# EAGLE design schematic (EAGLE 7.5.0)
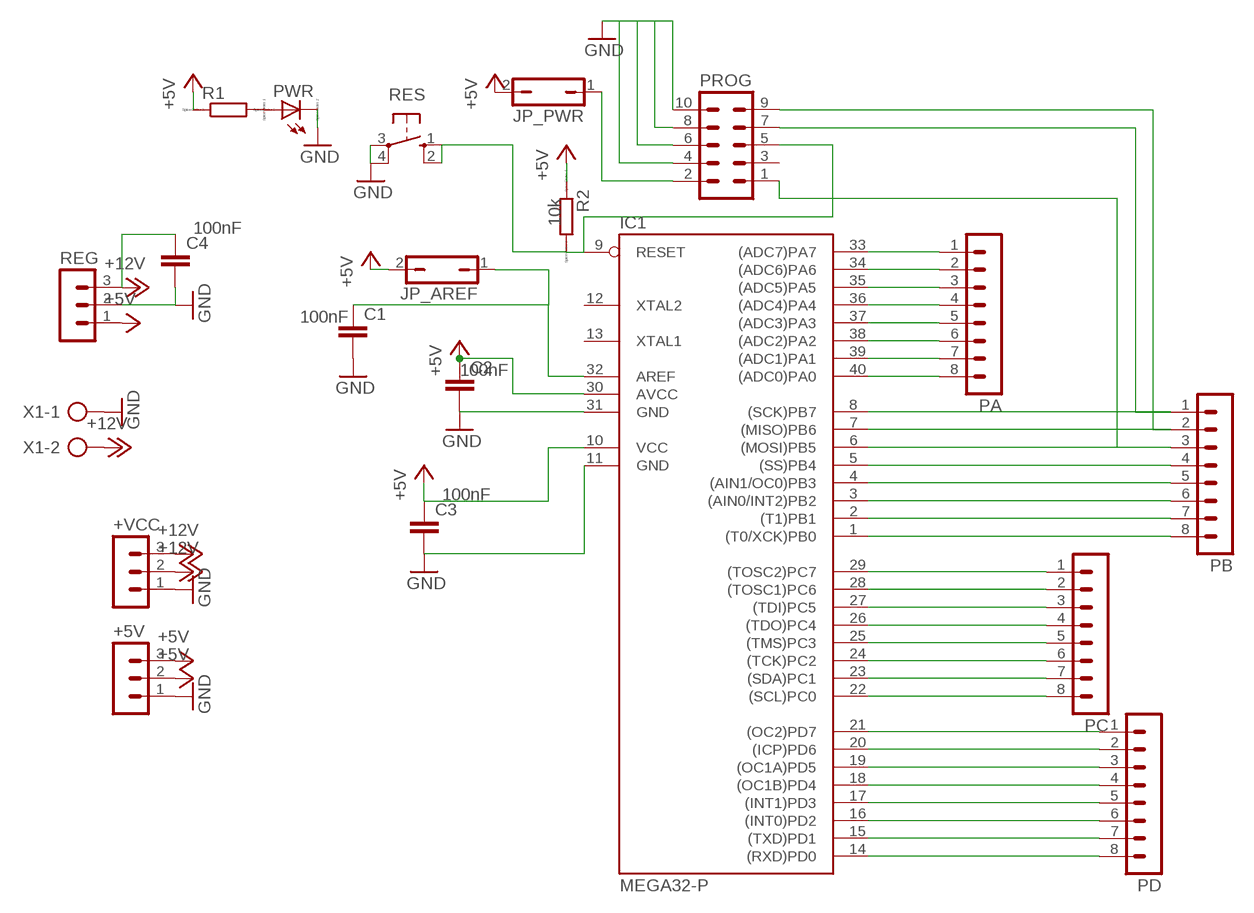
[diagram p0: schematic, sheet 1]

## Parts
+5V  MA03-1  [MA03-1]
+VCC  MA03-1  [MA03-1]
C1  C2,5-3  [C2.5-3]
C2  C2,5-3  [C2.5-3]
C3  C2,5-3  [C2.5-3]
C4  C2,5-3  [C2.5-3]
IC1  MEGA32-P  [DIL40]
JP_AREF  JP1Q  [JP1]
JP_PWR  JP1Q  [JP1]
PA  MA08-1  [MA08-1]
PB  MA08-1  [MA08-1]
PC  MA08-1  [MA08-1]
PD  MA08-1  [MA08-1]
PROG  MA05-2  [MA05-2]
PWR  LED_E  [LED_1206]
R1  RR1206  [R1206]
R2  RR1206  [R1206]
REG  MA03-1  [MA03-1]
RES  10-XX  [B3F-10XX]
X1  AK300/2  [AK300/2]

## Nets
+5V: +5V.2 +5V.3 C2.1 C3.1 IC1.10(VCC) IC1.30(AVCC) JP_AREF.2 JP_PWR.2 R1.1 R2.1 REG.1
+12V: +VCC.2 +VCC.3 C4.1 REG.3 X1.2
GND: +5V.1 +VCC.1 C1.2 C2.2 C3.2 C4.2 IC1.11(GND) IC1.31(GND) PROG.4 PROG.6 PROG.8 PROG.10 PWR.C REG.2 RES.3(P) RES.4(P1) X1.1
N$1: IC1.21((OC2)PD7) PD.1
N$2: IC1.20((ICP)PD6) PD.2
N$3: IC1.19((OC1A)PD5) PD.3
N$4: IC1.18((OC1B)PD4) PD.4
N$5: IC1.17((INT1)PD3) PD.5
N$6: IC1.16((INT0)PD2) PD.6
N$7: IC1.15((TXD)PD1) PD.7
N$8: IC1.14((RXD)PD0) PD.8
N$9: IC1.29((TOSC2)PC7) PC.1
N$10: IC1.28((TOSC1)PC6) PC.2
N$11: IC1.27((TDI)PC5) PC.3
N$12: IC1.26((TDO)PC4) PC.4
N$13: IC1.25((TMS)PC3) PC.5
N$14: IC1.24((TCK)PC2) PC.6
N$15: IC1.23((SDA)PC1) PC.7
N$16: IC1.22((SCL)PC0) PC.8
N$17: IC1.8((SCK)PB7) PB.1 PROG.7
N$18: IC1.7((MISO)PB6) PB.2 PROG.9
N$19: IC1.6((MOSI)PB5) PB.3 PROG.1
N$20: IC1.5((SS)PB4) PB.4
N$21: IC1.4((AIN1/OC0)PB3) PB.5
N$22: IC1.3((AIN0/INT2)PB2) PB.6
N$23: IC1.2((T1)PB1) PB.7
N$24: IC1.1((T0/XCK)PB0) PB.8
N$25: IC1.33((ADC7)PA7) PA.1
N$26: IC1.34((ADC6)PA6) PA.2
N$27: IC1.35((ADC5)PA5) PA.3
N$28: IC1.36((ADC4)PA4) PA.4
N$29: IC1.37((ADC3)PA3) PA.5
N$30: IC1.38((ADC2)PA2) PA.6
N$31: IC1.39((ADC1)PA1) PA.7
N$32: IC1.40((ADC0)PA0) PA.8
N$33: IC1.9(RESET) PROG.5 R2.2 RES.1(S) RES.2(S1)
N$35: C1.1 IC1.32(AREF) JP_AREF.1
N$37: JP_PWR.1 PROG.2
N$42: PWR.A R1.2
Unconnected: IC1.12(XTAL2) IC1.13(XTAL1) PROG.3

## Library data of the parts
+5V +VCC REG = con-lstb:MA03-1: PIN HEADER; OC_FARNELL: unknown; OC_NEWARK: unknown
C1-C4 = capacitor-wima:C: CAPACITOR naming: grid - package width; CAPACITY: 100nF
IC1 = atmel:MEGA32-P: MICROCONTROLLER 32 Kbytes FLASH 2 Kbytes SRAM 1 Kbytes EEPROM USART 8-channel 10 bit ADC Source: www.atmel.com .. doc2503.pdf; MPN: ATMEGA32-16PU; OC_FARNELL: 1661729; OC_NEWARK: 51P1794
JP_AREF JP_PWR = jumper:JP1Q: JUMPER
PA PB PC PD = con-lstb:MA08-1: PIN HEADER; OC_FARNELL: unknown; OC_NEWARK: unknown
PROG = con-lstb:MA05-2: PIN HEADER; OC_FARNELL: unknown; OC_NEWARK: unknown
PWR = eagle-ltspice:LED_E: LED Source: http://www.osram.convergy.de Source: www.luxeon.com Source: www.kingbright.com; SPICEMODEL: NONE; SPICEPREFIX: D; SPICETYPE: diode
R1 = eagle-ltspice:R: RESISTOR, European symbol; SPICEMODEL: NONE; SPICEPREFIX: R
R2 = eagle-ltspice:R: RESISTOR, European symbol; SPICEMODEL: 10k; SPICEPREFIX: R
RES = switch-omron:10-XX: OMRON SWITCH; MPN: B3F-1000; OC_FARNELL: 176432; OC_NEWARK: 36M3542
X1 = con-ptr500:AK300/2: CONNECTOR; OC_FARNELL: unknown; OC_NEWARK: unknown

## Board
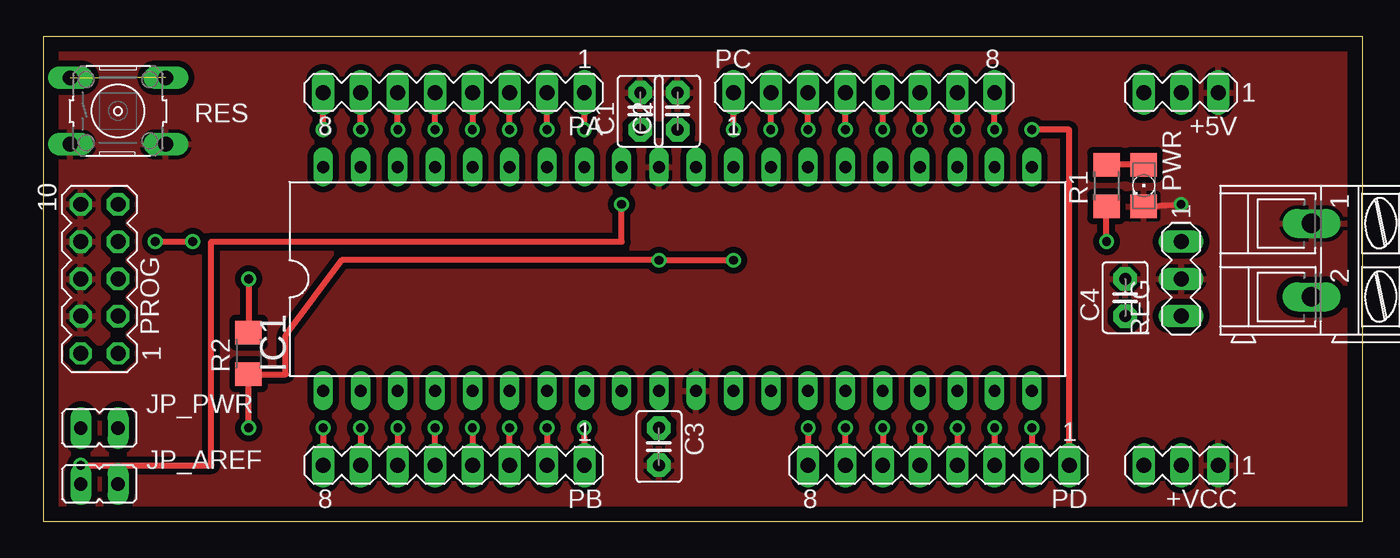
[diagram p1: board, top side]
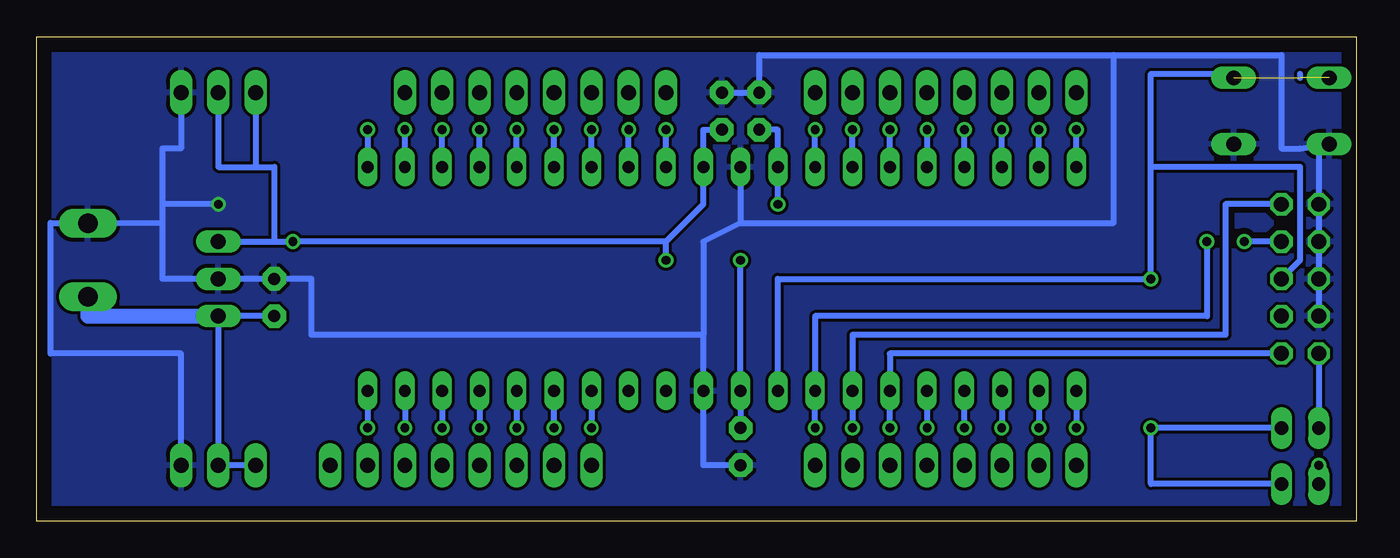
[diagram p2: board, bottom side, seen from below]

Size 89.84 x 33.01 mm. Coordinates in mm from the lower left corner, seen from the top.
Outline: 0,0 89.84,0 89.84,33.01 0,33.01 0,0
Copper layers (1*16): Top 0.035mm / dielectric 1.5mm / Bottom 0.035mm
Design rules "default": minimum track width 10mil, minimum drill 24mil, track to track 8mil, track to pad 8mil, pad to pad 8mil, via to via 8mil, smd to smd 8mil, copper to edge 40mil, drill to drill 8mil, minimum pad ring 10mil, minimum via ring 8mil, stop-mask expansion 4mil, vias tented up to drill 0mil, thermal gap 10mil

### Footprints (pad centres in the part's own frame; a part is rotated, then mirrored left to right if it is on the bottom)
MA03-1 = drill 1.016 long: 1 -2.54,0; 2 0,0; 3 2.54,0
C2.5-3 = drill 0.813 pad 1.6 octagon: 1 -1.27,0; 2 1.27,0
DIL40 = drill 0.813 long: 1 -24.13,-7.62; 2 -21.59,-7.62; 3 -19.05,-7.62; 4 -16.51,-7.62; 5 -13.97,-7.62; 6 -11.43,-7.62; 7 -8.89,-7.62; 8 -6.35,-7.62; 9 -3.81,-7.62; 10 -1.27,-7.62; 11 1.27,-7.62; 12 3.81,-7.62; 13 6.35,-7.62; 14 8.89,-7.62; 15 11.43,-7.62; 16 13.97,-7.62; 17 16.51,-7.62; 18 19.05,-7.62; 19 21.59,-7.62; 20 24.13,-7.62; 21 24.13,7.62; 22 21.59,7.62; 23 19.05,7.62; 24 16.51,7.62; 25 13.97,7.62; 26 11.43,7.62; 27 8.89,7.62; 28 6.35,7.62; 29 3.81,7.62; 30 1.27,7.62; 31 -1.27,7.62; 32 -3.81,7.62; 33 -6.35,7.62; 34 -8.89,7.62; 35 -11.43,7.62; 36 -13.97,7.62; 37 -16.51,7.62; 38 -19.05,7.62; 39 -21.59,7.62; 40 -24.13,7.62
JP1 = drill 0.914 long: 1 0,-1.27; 2 0,1.27
MA08-1 = drill 1.016 long: 1 -8.89,0; 2 -6.35,0; 3 -3.81,0; 4 -1.27,0; 5 1.27,0; 6 3.81,0; 7 6.35,0; 8 8.89,0
MA05-2 = drill 1.016 octagon: 1 -5.08,-1.27; 2 -5.08,1.27; 3 -2.54,-1.27; 4 -2.54,1.27; 5 0,-1.27; 6 0,1.27; 7 2.54,-1.27; 8 2.54,1.27; 9 5.08,-1.27; 10 5.08,1.27
LED_1206 = smd 1.6 x 1.803: A -1.422,0; C 1.422,0
R1206 = smd 1.6 x 1.803: 1 -1.422,0; 2 1.422,0
B3F-10XX = drill 1.016 long: 1 -3.251,2.261; 2 3.251,2.261; 3 -3.251,-2.261; 4 3.251,-2.261
AK300/2 = drill 1.321 long: 1 -2.515,0; 2 2.489,0

### Placement (x,y rotation side)
+5V  77.47,29.21 180 top
+VCC  77.47,3.81 180 top
C1  40.64,27.94 90 top
C2  43.18,27.94 90 top
C3  41.91,5.08 270 top
C4  73.66,15.24 90 top
IC1  43.18,16.51 0 top
JP_AREF  3.81,2.54 270 top
JP_PWR  3.81,6.35 270 top
PA  27.94,29.21 180 top
PB  27.94,3.81 180 top
PC  55.88,29.21 0 top
PD  60.96,3.81 180 top
PROG  3.81,16.51 90 top
PWR  74.93,22.86 270 top
R1  72.39,22.86 90 top
R2  13.97,11.43 90 top
REG  77.47,16.51 270 top
RES  5.08,27.94 0 top
X1  86.36,17.78 270 top

### Tracks (layer width: path | path; a pad name or v marks a point on that pad's centre or on a via)
+5V  (via drill 0.6)
  Top 0.406: v72.39,19.05 R1.1 | v46.99,17.78 v41.91,17.78 20.32,17.78 16.51,12.7 16.51,10.01 R2.1 v13.97,6.35
  Bottom 0.406: REG.1 73.66,19.05 | 73.66,19.05 v72.39,19.05 46.99,19.05 | C2.1 44.45,26.67 IC1.30 44.45,21.59 46.99,19.05 | C3.1 IC1.10 v41.91,17.78 | v46.99,17.78 46.99,19.05 | JP_PWR.2 v13.97,6.35 13.97,2.54 JP_AREF.2 | +5V.2 77.47,24.13 74.93,24.13 | 74.93,24.13 73.66,24.13 73.66,19.05 | +5V.3 74.93,24.13
+12V
  Bottom 0.406: C4.1 REG.3 +VCC.2 +VCC.3
  Bottom 1.016: X1.2 86.36,13.97 REG.3
GND  (via drill 0.6)
  Top 0.406: PWR.C v77.47,21.59
  Bottom 0.406: 44.45,12.7 44.45,19.05 41.91,20.32 | IC1.31 41.91,20.32 | 41.91,20.32 16.51,20.32 16.51,31.75 | 16.51,31.75 5.08,31.75 5.08,25.4 3.81,25.4 RES.3 2.54,25.4 PROG.10 PROG.8 PROG.6 PROG.4 | 44.45,12.7 71.12,12.7 71.12,16.51 C4.2 REG.2 81.28,16.51 81.28,20.32 | 44.45,12.7 IC1.11 44.45,3.81 C3.2 | C2.2 C1.2 40.64,31.75 16.51,31.75 | v77.47,21.59 81.28,21.59 | 81.28,21.59 81.28,20.32 | 81.28,20.32 X1.1 86.36,20.32 88.9,20.32 88.9,11.43 80.01,11.43 +VCC.1 | +5V.1 80.01,25.4 81.28,25.4 81.28,21.59
  pour Bottom (isolate 0.406): 0,33.02 90.17,33.02 90.17,0 0,0
  pour Top (isolate 0.406): 0,33.02 0,0 90.17,0 90.17,33.02
  pour Bottom: 0,33.02 90.17,33.02 90.17,0 0,0
N$1  (via drill 0.6)
  Top 0.406: PD.1 69.85,26.67 v67.31,26.67
  Bottom 0.406: v67.31,26.67 IC1.21
N$2  (via drill 0.6)
  Top 0.406: v67.31,6.35 PD.2
  Bottom 0.406: IC1.20 v67.31,6.35
N$3  (via drill 0.6)
  Top 0.406: v64.77,6.35 PD.3
  Bottom 0.406: IC1.19 v64.77,6.35
N$4  (via drill 0.6)
  Top 0.406: v62.23,6.35 PD.4
  Bottom 0.406: IC1.18 v62.23,6.35
N$5  (via drill 0.6)
  Top 0.406: v59.69,6.35 PD.5
  Bottom 0.406: IC1.17 v59.69,6.35
N$6  (via drill 0.6)
  Top 0.406: v57.15,6.35 PD.6
  Bottom 0.406: IC1.16 v57.15,6.35
N$7  (via drill 0.6)
  Top 0.406: PD.7 v54.61,6.35
  Bottom 0.406: v54.61,6.35 IC1.15
N$8  (via drill 0.6)
  Top 0.406: v52.07,6.35 PD.8
  Bottom 0.406: IC1.14 v52.07,6.35
N$9  (via drill 0.6)
  Top 0.406: v46.99,26.67 PC.1
  Bottom 0.406: IC1.29 v46.99,26.67
N$10  (via drill 0.6)
  Top 0.406: v49.53,26.67 PC.2
  Bottom 0.406: IC1.28 v49.53,26.67
N$11  (via drill 0.6)
  Top 0.406: v52.07,26.67 PC.3
  Bottom 0.406: IC1.27 v52.07,26.67
N$12  (via drill 0.6)
  Top 0.406: v54.61,26.67 PC.4
  Bottom 0.406: IC1.26 v54.61,26.67
N$13  (via drill 0.6)
  Top 0.406: v57.15,26.67 PC.5
  Bottom 0.406: IC1.25 v57.15,26.67
N$14  (via drill 0.6)
  Top 0.406: v59.69,26.67 PC.6
  Bottom 0.406: IC1.24 v59.69,26.67
N$15  (via drill 0.6)
  Top 0.406: v62.23,26.67 PC.7
  Bottom 0.406: IC1.23 v62.23,26.67
N$16  (via drill 0.6)
  Top 0.406: v64.77,26.67 PC.8
  Bottom 0.406: IC1.22 v64.77,26.67
N$17  (via drill 0.6)
  Top 0.406: PB.1 v36.83,6.35 | v7.62,19.05 v10.16,19.05
  Bottom 0.406: v36.83,6.35 IC1.8 36.83,13.97 10.16,13.97 v10.16,19.05 | PROG.7 v7.62,19.05
N$18  (via drill 0.6)
  Top 0.406: v34.29,6.35 PB.2
  Bottom 0.406: v34.29,6.35 IC1.7 34.29,12.7 8.89,12.7 8.89,21.59 PROG.9
N$19  (via drill 0.6)
  Top 0.406: PB.3 v31.75,6.35
  Bottom 0.406: v31.75,6.35 IC1.6 31.75,11.43 PROG.1
N$20  (via drill 0.6)
  Top 0.406: v29.21,6.35 PB.4
  Bottom 0.406: IC1.5 v29.21,6.35
N$21  (via drill 0.6)
  Top 0.406: PB.5 v26.67,6.35
  Bottom 0.406: v26.67,6.35 IC1.4
N$22  (via drill 0.6)
  Top 0.406: v24.13,6.35 PB.6
  Bottom 0.406: IC1.3 v24.13,6.35
N$23  (via drill 0.6)
  Top 0.406: v21.59,6.35 PB.7
  Bottom 0.406: IC1.2 v21.59,6.35
N$24  (via drill 0.6)
  Top 0.406: v19.05,6.35 PB.8
  Bottom 0.406: IC1.1 v19.05,6.35
N$25  (via drill 0.6)
  Top 0.406: v36.83,26.67 PA.1
  Bottom 0.406: IC1.33 v36.83,26.67
N$26  (via drill 0.6)
  Top 0.406: v34.29,26.67 PA.2
  Bottom 0.406: IC1.34 v34.29,26.67
N$27  (via drill 0.6)
  Top 0.406: v31.75,26.67 PA.3
  Bottom 0.406: IC1.35 v31.75,26.67
N$28  (via drill 0.6)
  Top 0.406: PA.4 v29.21,26.67
  Bottom 0.406: v29.21,26.67 IC1.36
N$29  (via drill 0.6)
  Top 0.406: v26.67,26.67 PA.5
  Bottom 0.406: IC1.37 v26.67,26.67
N$30  (via drill 0.6)
  Top 0.406: v24.13,26.67 PA.6
  Bottom 0.406: IC1.38 v24.13,26.67
N$31  (via drill 0.6)
  Top 0.406: v21.59,26.67 PA.7
  Bottom 0.406: IC1.39 v21.59,26.67
N$32  (via drill 0.6)
  Top 0.406: v19.05,26.67 PA.8
  Bottom 0.406: IC1.40 v19.05,26.67
N$33  (via drill 0.6)  (2 unrouted)
  Top 0.406: v13.97,16.51 R2.2
  Bottom 0.406: 3.81,30.2 3.81,30.48 | IC1.9 39.37,16.51 v13.97,16.51 13.97,24.13 | 13.97,24.13 13.97,30.48 8.61,30.48 RES.2 | PROG.5 3.81,17.78 3.81,24.13 13.97,24.13
N$35  (via drill 0.6)
  Top 0.406: v2.54,3.81 11.43,3.81 11.43,19.05 39.37,19.05 v39.37,21.59
  Bottom 0.406: C1.1 39.37,26.67 IC1.32 v39.37,21.59 | JP_AREF.1 v2.54,3.81
N$37
  Bottom 0.406: PROG.2 JP_PWR.1
N$42
  Top 0.406: PWR.A R1.2